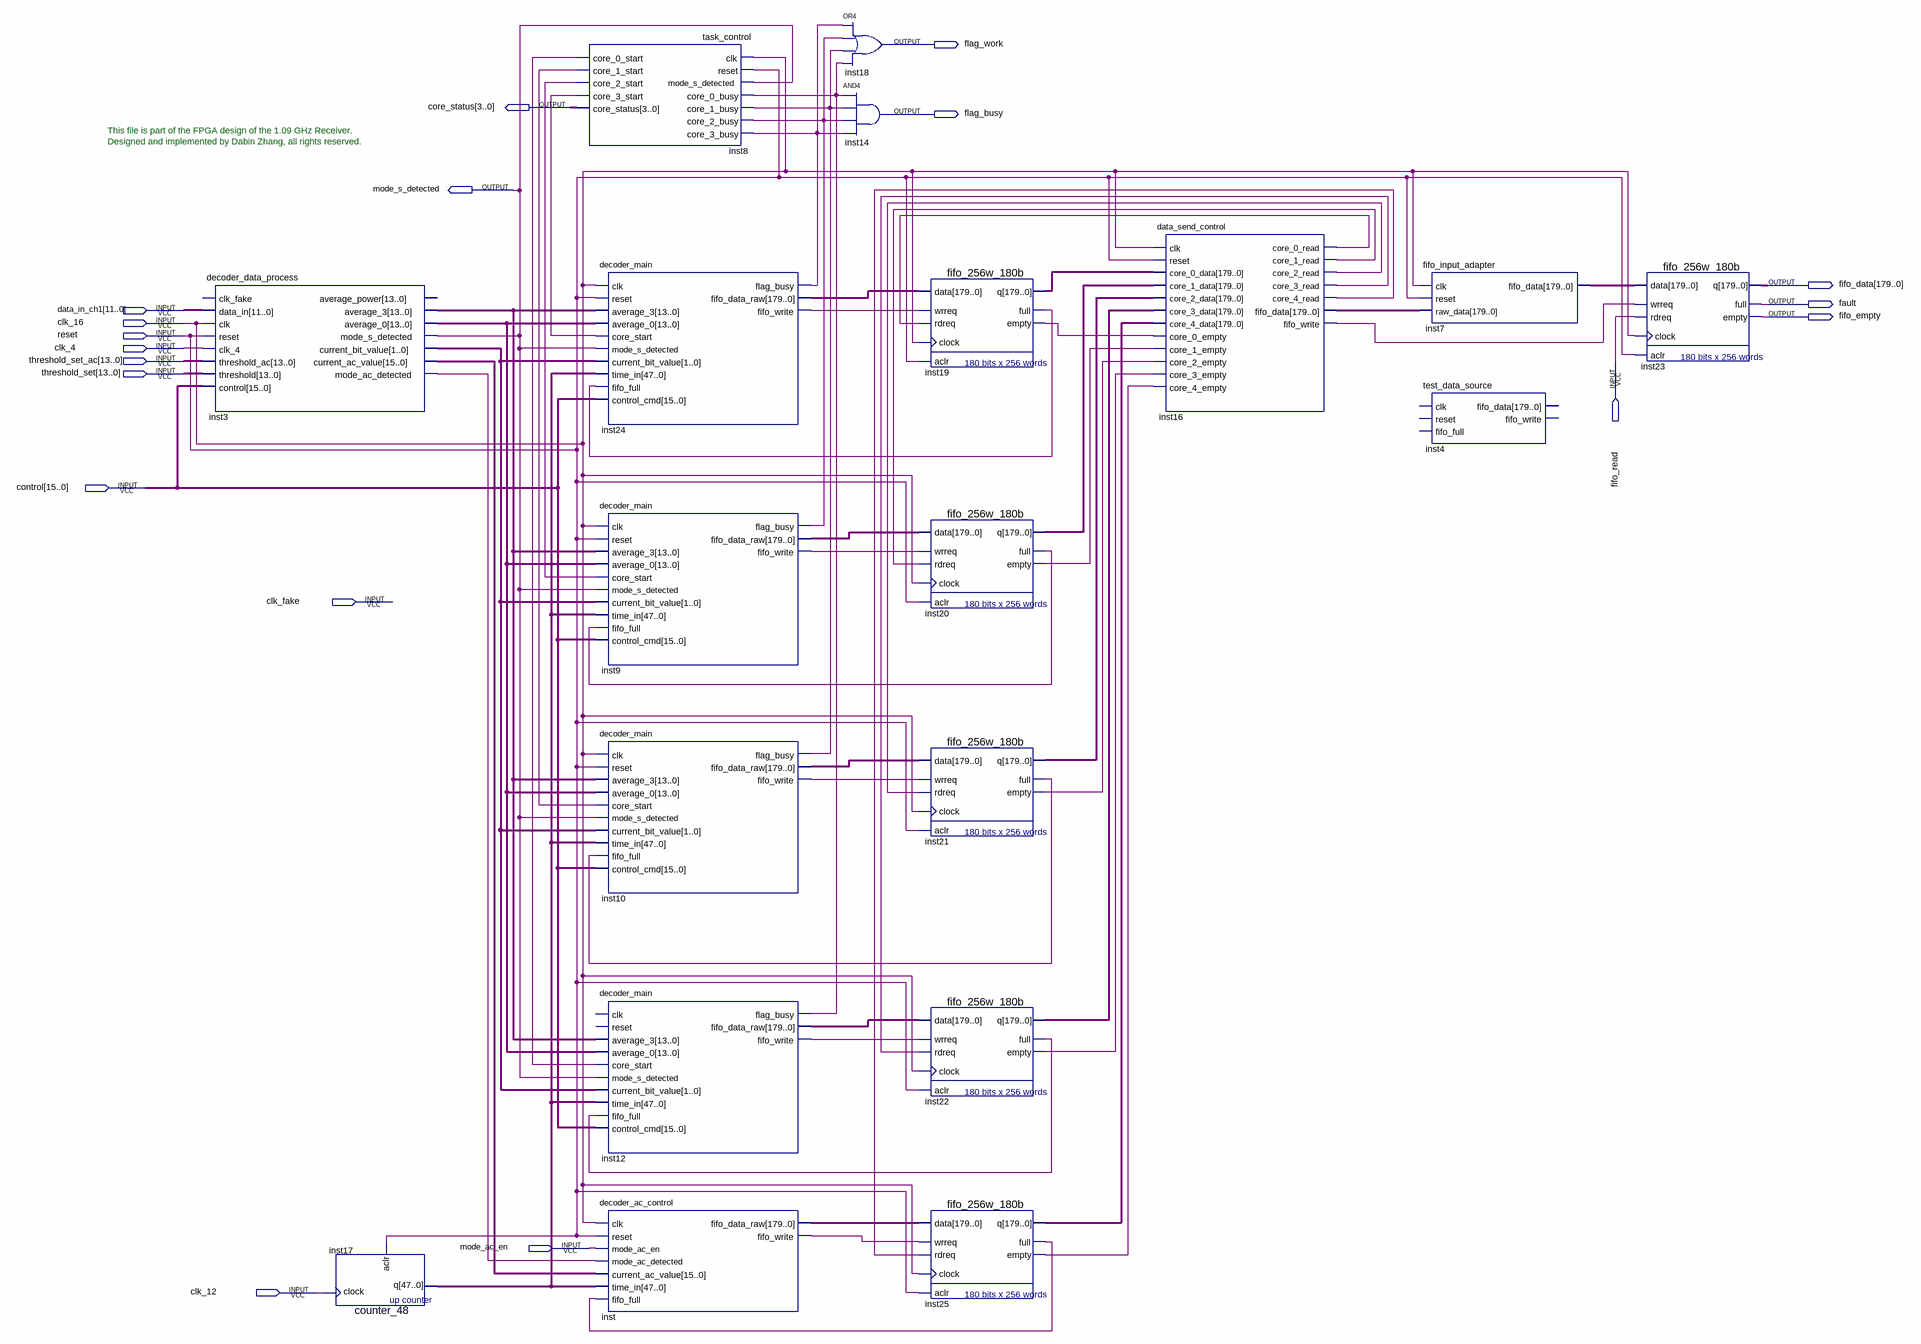
[diagram p0: schematic sheet]
// Quartus schematic decoder_unit.bdf as structural Verilog: 19 symbols, 18 pins
module decoder_unit (
  input  [11:0] data_in_ch1,
  input  clk_16,
  input  reset,
  input  clk_4,
  input  [13:0] threshold_set_ac,
  input  fifo_read,
  input  [13:0] threshold_set,
  input  [15:0] control,
  input  clk_fake,
  input  mode_ac_en,
  input  clk_12,
  output flag_work,
  output [3:0] core_status,
  output flag_busy,
  output mode_s_detected,
  output [179:0] fifo_data,
  output fault,
  output fifo_empty
);

  wire inst3_mode_ac_detected, inst8_core_0_start, inst8_core_1_start, inst8_core_2_start,
       inst8_core_3_start, inst9_fifo_write, inst9_flag_busy, inst10_fifo_write, inst10_flag_busy,
       inst12_fifo_write, inst12_flag_busy, inst16_core_0_read, inst16_core_1_read, inst16_core_2_read,
       inst16_core_3_read, inst16_core_4_read, inst16_fifo_write, inst19_empty, inst19_full, inst20_empty,
       inst20_full, inst21_empty, inst21_full, inst22_empty, inst22_full, inst24_fifo_write,
       inst24_flag_busy, inst25_empty, inst25_full, inst_fifo_write;
  wire [1:0] inst3_current_bit_value;
  wire [13:0] inst3_average_0, inst3_average_3;
  wire [15:0] inst3_current_ac_value;
  wire [47:0] inst17_q;
  wire [179:0] inst7_fifo_data, inst9_fifo_data_raw, inst10_fifo_data_raw, inst12_fifo_data_raw,
       inst16_fifo_data, inst19_q, inst20_q, inst21_q, inst22_q, inst24_fifo_data_raw, inst25_q,
       inst_fifo_data_raw;

  decoder_data_process inst3 (
    .data_in(data_in_ch1), .clk(clk_16), .reset(reset), .clk_4(clk_4), .threshold_ac(threshold_set_ac),
    .threshold(threshold_set), .control(control), .average_3(inst3_average_3), .average_0(inst3_average_0),
    .mode_s_detected(mode_s_detected), .current_bit_value(inst3_current_bit_value),
    .current_ac_value(inst3_current_ac_value), .mode_ac_detected(inst3_mode_ac_detected));  // open: clk_fake, average_power
  counter_48 inst17 (.clock(clk_12), .aclr(reset), .q(inst17_q));
  task_control inst8 (
    .clk(clk_16), .reset(reset), .mode_s_detected(mode_s_detected), .core_0_busy(inst12_flag_busy),
    .core_1_busy(inst10_flag_busy), .core_2_busy(inst9_flag_busy), .core_3_busy(inst24_flag_busy),
    .core_0_start(inst8_core_0_start), .core_1_start(inst8_core_1_start), .core_2_start(inst8_core_2_start),
    .core_3_start(inst8_core_3_start), .core_status(core_status));
  decoder_main inst24 (
    .clk(clk_16), .reset(reset), .average_3(inst3_average_3), .average_0(inst3_average_0),
    .core_start(inst8_core_3_start), .mode_s_detected(mode_s_detected),
    .current_bit_value(inst3_current_bit_value), .time_in(inst17_q), .fifo_full(inst19_full),
    .control_cmd(control), .flag_busy(inst24_flag_busy), .fifo_data_raw(inst24_fifo_data_raw),
    .fifo_write(inst24_fifo_write));
  decoder_main inst9 (
    .clk(clk_16), .reset(reset), .average_3(inst3_average_3), .average_0(inst3_average_0),
    .core_start(inst8_core_2_start), .mode_s_detected(mode_s_detected),
    .current_bit_value(inst3_current_bit_value), .time_in(inst17_q), .fifo_full(inst20_full),
    .control_cmd(control), .flag_busy(inst9_flag_busy), .fifo_data_raw(inst9_fifo_data_raw),
    .fifo_write(inst9_fifo_write));
  decoder_main inst10 (
    .clk(clk_16), .reset(reset), .average_3(inst3_average_3), .average_0(inst3_average_0),
    .core_start(inst8_core_1_start), .mode_s_detected(mode_s_detected),
    .current_bit_value(inst3_current_bit_value), .time_in(inst17_q), .fifo_full(inst21_full),
    .control_cmd(control), .flag_busy(inst10_flag_busy), .fifo_data_raw(inst10_fifo_data_raw),
    .fifo_write(inst10_fifo_write));
  decoder_main inst12 (
    .average_3(inst3_average_3), .average_0(inst3_average_0), .core_start(inst8_core_0_start),
    .mode_s_detected(mode_s_detected), .current_bit_value(inst3_current_bit_value), .time_in(inst17_q),
    .fifo_full(inst22_full), .control_cmd(control), .flag_busy(inst12_flag_busy),
    .fifo_data_raw(inst12_fifo_data_raw), .fifo_write(inst12_fifo_write));  // open: clk, reset
  decoder_ac_control inst (
    .clk(clk_16), .reset(reset), .mode_ac_en(mode_ac_en), .mode_ac_detected(inst3_mode_ac_detected),
    .current_ac_value(inst3_current_ac_value), .time_in(inst17_q), .fifo_full(inst25_full),
    .fifo_data_raw(inst_fifo_data_raw), .fifo_write(inst_fifo_write));
  or inst18 (flag_work, inst24_flag_busy, inst9_flag_busy, inst10_flag_busy, inst12_flag_busy);
  and inst14 (flag_busy, inst12_flag_busy, inst10_flag_busy, inst9_flag_busy, inst24_flag_busy);
  fifo_256w_180b inst19 (
    .data(inst24_fifo_data_raw), .wrreq(inst24_fifo_write), .rdreq(inst16_core_0_read), .clock(clk_16),
    .aclr(reset), .q(inst19_q), .full(inst19_full), .empty(inst19_empty));
  fifo_256w_180b inst20 (
    .data(inst9_fifo_data_raw), .wrreq(inst9_fifo_write), .rdreq(inst16_core_1_read), .clock(clk_16),
    .aclr(reset), .q(inst20_q), .full(inst20_full), .empty(inst20_empty));
  fifo_256w_180b inst21 (
    .data(inst10_fifo_data_raw), .wrreq(inst10_fifo_write), .rdreq(inst16_core_2_read), .clock(clk_16),
    .aclr(reset), .q(inst21_q), .full(inst21_full), .empty(inst21_empty));
  fifo_256w_180b inst22 (
    .data(inst12_fifo_data_raw), .wrreq(inst12_fifo_write), .rdreq(inst16_core_3_read), .clock(clk_16),
    .aclr(reset), .q(inst22_q), .full(inst22_full), .empty(inst22_empty));
  fifo_256w_180b inst25 (
    .data(inst_fifo_data_raw), .wrreq(inst_fifo_write), .rdreq(inst16_core_4_read), .clock(clk_16),
    .aclr(reset), .q(inst25_q), .full(inst25_full), .empty(inst25_empty));
  data_send_control inst16 (
    .clk(clk_16), .reset(reset), .core_0_data(inst19_q), .core_1_data(inst20_q), .core_2_data(inst21_q),
    .core_3_data(inst22_q), .core_4_data(inst25_q), .core_0_empty(inst19_empty), .core_1_empty(inst20_empty),
    .core_2_empty(inst21_empty), .core_3_empty(inst22_empty), .core_4_empty(inst25_empty),
    .core_0_read(inst16_core_0_read), .core_1_read(inst16_core_1_read), .core_2_read(inst16_core_2_read),
    .core_3_read(inst16_core_3_read), .core_4_read(inst16_core_4_read), .fifo_data(inst16_fifo_data),
    .fifo_write(inst16_fifo_write));
  fifo_input_adapter inst7 (.clk(clk_16), .reset(reset), .raw_data(inst16_fifo_data), .fifo_data(inst7_fifo_data));
  test_data_source inst4 ();  // open: clk, reset, fifo_full, fifo_data, fifo_write
  fifo_256w_180b inst23 (
    .data(inst7_fifo_data), .wrreq(inst16_fifo_write), .rdreq(fifo_read), .clock(clk_16), .aclr(reset),
    .q(fifo_data), .full(fault), .empty(fifo_empty));

  // Notes on the sheet:
  //   This file is part of the FPGA design of the 1.09 GHz Receiver.
  //   Designed and implemented by Dabin Zhang, all rights reserved.
endmodule
